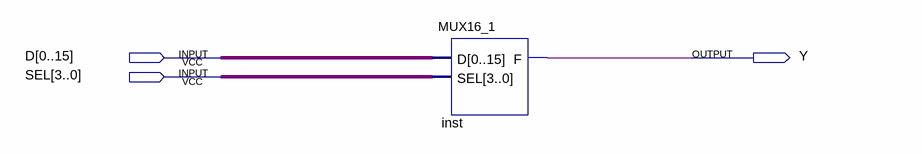
[diagram p0: schematic sheet]
// Quartus schematic ex4p1.bdf as structural Verilog: 1 symbols, 3 pins
module ex4p1 (
  input  [0:15] D,
  input  [3:0] SEL,
  output Y
);

  MUX16_1 inst (.D(D), .SEL(SEL), .F(Y));
endmodule
